# Altium schematic sheet captivate_phone.SchDoc: TICAPEVM_PHONE Capacitive Touch Panel PCB
size Letter; Date: Not shown in title block; ApprovedBy: Not shown in title block; CheckedBy: Not shown in title block; Author: Not shown in title block; CompanyName: Not shown in title block; Engineer: Not shown in title block; Organization: Not shown in title block; Address1: Not shown in title block; Address2: Not shown in title block; Address3: Not shown in title block; Address4: Not shown in title block; DocumentNumber: 1; Revision: Use project parameter SCH_Rev; SheetNumber: 1; SheetTotal: 1; PageSetup: Record=PageOptions|CenterHorizontal=True|CenterVertical=True|PrintScale=0.94|XCorrection=1.00|YCorrection=1.00|PrintKind=0|BorderSize=5000000|LeftOffset=0|BottomOffset=0|Orientation=2|PaperLength=1000|PaperWidth=1000|Scale=100|PaperSource=15|PrintQuality=600|MediaType=1|DitherType=10|PaperKind=Letter|PrintScaleMode=1; CurrentTime: Not shown in title block; CurrentDate: Not shown in title block; Time: Not shown in title block; DocumentFullPathAndName: Not shown in title block; DocumentName: Not shown in title block; ModifiedDate: Not shown in title block; ImagePath: Not shown in title block
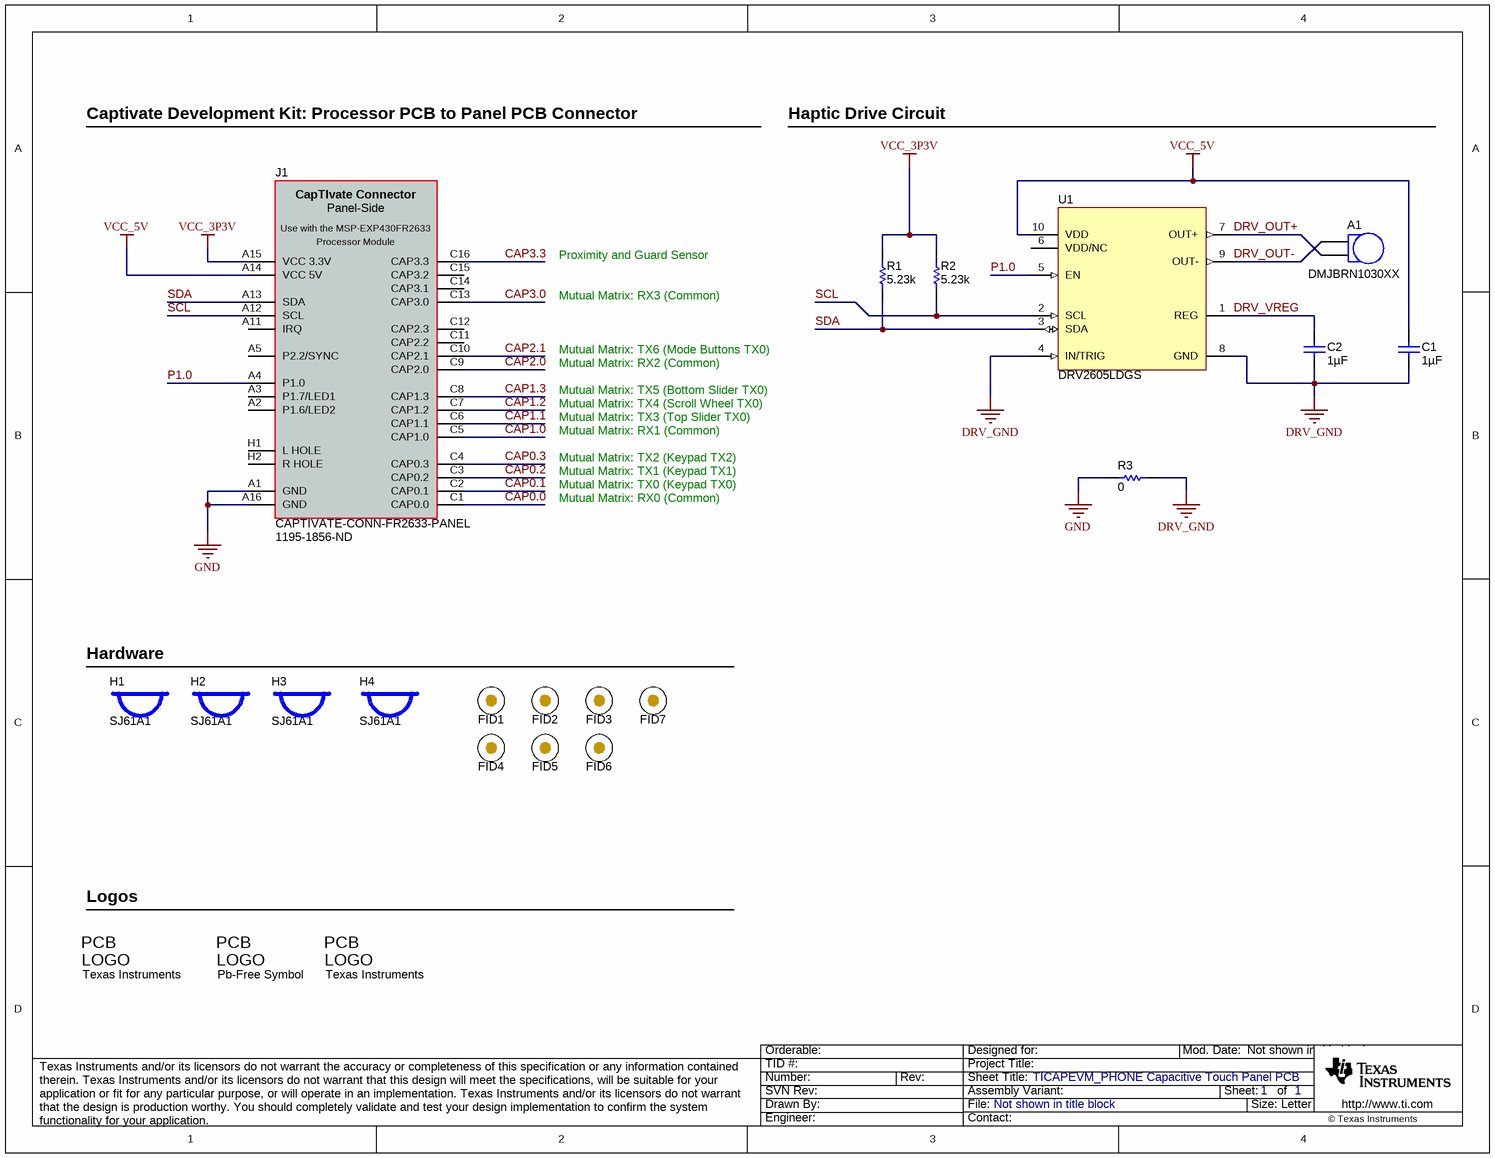
[diagram p0: captivate_phone.SchDoc]

## Parts
A1  DMJBRN1030XX  [SEMCO1030]
C1  ValueDisplayed: 1µF  [0603]  (hidden comment: C0603C105K8PACTU)
C2  ValueDisplayed: 1µF  [0603]  (hidden comment: C0603C105K8PACTU)
FID1  Fiducial  [Fiducial10-20]  (value not drawn)
FID2  Fiducial  [Fiducial10-20]  (value not drawn)
FID3  Fiducial  [Fiducial10-20]  (value not drawn)
FID4  Fiducial  [Fiducial10-20]  (value not drawn)
FID5  Fiducial  [Fiducial10-20]  (value not drawn)
FID6  Fiducial  [Fiducial10-20]  (value not drawn)
FID7  Fiducial  [Fiducial10-20]  (value not drawn)
H1  SJ61A1  [Bumpon_SJ61A1]
H2  SJ61A1  [Bumpon_SJ61A1]
H3  SJ61A1  [Bumpon_SJ61A1]
H4  SJ61A1  [Bumpon_SJ61A1]
J1  CAPTIVATE-CONN-FR2633-PANEL  Supplier Part Number 1: 1195-1856-ND  [CAPTIVATE-CONN-48]
Logo1  Pb-Free Symbol  [Pb-Free_Overlay_Medium]  (no BOM)
Logo2  Texas Instruments  [TI_Horizontal_Overlay_Medium]  (no BOM)
Logo3  Texas Instruments  [TI_Horizontal_Overlay_Medium]  (no BOM)
R1  ValueDisplayed: 5.23k  [0603]  (hidden comment: CRCW06035K23FKEA)
R2  ValueDisplayed: 5.23k  [0603]  (hidden comment: CRCW06035K23FKEA)
R3  ValueDisplayed: 0  [0603]  (hidden comment: CRCW06030000Z0EA)
U1  DRV2605LDGS  [DGS0010A_L]

## Nets
DRV_GND: C1.2 C2.2 R3.1 U1.4(IN/TRIG) U1.8(GND)
GND: J1.A1(GND) J1.A16(GND) R3.2
VCC_3P3V: J1.A15(VCC_3.3V) R1.2 R2.2
VCC_5V: C1.1 J1.A14(VCC_5V) U1.10(VDD)
CAP0.0: J1.C1(CAP0.0)
CAP0.1: J1.C2(CAP0.1)
CAP0.2: J1.C3(CAP0.2)
CAP0.3: J1.C4(CAP0.3)
CAP1.0: J1.C5(CAP1.0)
CAP1.1: J1.C6(CAP1.1)
CAP1.2: J1.C7(CAP1.2)
CAP1.3: J1.C8(CAP1.3)
CAP2.0: J1.C9(CAP2.0)
CAP2.1: J1.C10(CAP2.1)
CAP3.0: J1.C13(CAP3.0)
CAP3.3: J1.C16(CAP3.3)
DRV_OUT+: A1.2 U1.7(OUT+)
DRV_OUT-: A1.1 U1.9(OUT-)
DRV_VREG: C2.1 U1.1(REG)
P1.0: J1.A4(P1.0) U1.5(EN)
SCL: J1.A12(SCL) R2.1 U1.2(SCL)
SDA: J1.A13(SDA) R1.1 U1.3(SDA)

Not connected (* = marked no-connect by the designer): J1 A2(P1.6/LED2) A3(P1.7/LED1) A5(P2.2/SYNC) A11(IRQ) C11(CAP2.2) C12(CAP2.3) C14(CAP3.1) C15(CAP3.2) H1(L_HOLE) H2(R_HOLE); U1 6(VDD/NC)

## Notes on the sheet
- Captivate Development Kit: Processor PCB to Panel PCB Connector
- Haptic Drive Circuit
- Mutual Matrix: RX3 (Common)
- Proximity and Guard Sensor
- Mutual Matrix: RX2 (Common)
- Mutual Matrix: TX6 (Mode Buttons TX0)
- Mutual Matrix: RX1 (Common)
- Mutual Matrix: TX3 (Top Slider TX0)
- Mutual Matrix: TX4 (Scroll Wheel TX0)
- Mutual Matrix: TX5 (Bottom Slider TX0)
- Mutual Matrix: RX0 (Common)
- Mutual Matrix: TX0 (Keypad TX0)
- Mutual Matrix: TX1 (Keypad TX1)
- Mutual Matrix: TX2 (Keypad TX2)
- (near H1) Hardware
- (near Logo2) Logos
- Drawn By:
- SVN Rev:
- Number:
- TID #:
- Orderable:
- Rev:
- Sheet Title:
- File:
- Project Title:
- Designed for:
- Assembly Variant:
- Mod. Date:
- Sheet:
- Size:
- of
- Letter
- http://www.ti.com
- Texas Instruments and/or its licensors do not warrant the accuracy or completeness of this specification or any information contained therein. Texas Instruments and/or its licensors do not warrant that this design will meet the specifications, will be suitable for your application or fit for any particular purpose, or will operate in an implementation. Texas Instruments and/or its licensors do not warrant that the design is production worthy. You should completely validate and test your design implementation to confirm the system functionality for your application.
- Engineer:
- Contact:
- © Texas Instruments
- (in symbol CAPTIVATE-CONN-MSP-EXP430FR2633-PANEL) CapTIvate Connector; Panel-Side; Use with the MSP-EXP430FR2633; Processor Module
- (in symbol Pb-Free) PCB; LOGO
- (in symbol TI_Logo) PCB; LOGO

## Library data of the parts
A1 = DMJBRN1030XX: Linear Resonant Actuator; Manufacturer: Samsung Electro-Mechanics; SymbolCreator: a0273983; U/M: EA, IN, or GM; SymbolVersion: 2015-3-12; MountType: Wire lead, 30mm; RoHS: Y; PartNumber: DMJBRN1030XX; PackageReference: 10mm dia x 3mm height; ComponentLink1Description: Datasheet Link; CompType: Linear Resonant Actuator; Alternate PartNumber: -; Alternate Manufacturer: -; Supplier 1: Avnet; Supplier Part Number 1: DMJBRN1030BK
C1 C2 = C0603C105K8PACTU: CAP, CERM, 1 µF, 10 V, +/- 10%, X5R, 0603; Manufacturer: Kemet; Polarized: N; CompType: Capacitor; Value: 1uF; U/M: EA; Cap_F: 0.000001; Tolerance_%: 10; Value1: Unknown; Value2: 10V; TaMin_C: -55; TaMax_C: 85; SymbolVersion: 2008-07-09; PartNumber: C0603C105K8PACTU; PackageReference: 0603; RoHS: Y; VDC_V: 10; MountType: SMT; Technology: Ceramic; TempCo: X5R; Cap_Case: 0603; Published: 2008-06-19; Publisher: Texas Instruments; LatestRevisionDate: 2014-12-04; ComponentLink1Description: Datasheet link; ComponentLink1URL: http://www.kemet.com/kemet/web/homepage/kechome.nsf/vapubfiles/F3102_Y5V.pdf/$file/F3102_Y5V.pdf; Supplier 1: Digi-Key; Supplier Part Number 1: 399-3118-1-ND; Supplier 2: Mouser; Supplier Part Number 2: 80-C0603C105K8P; Supplier 3: Farnell; Supplier Part Number 3: 9227776
FID1-FID7 = Fiducial: Fiducial mark.  There is nothing to buy or mount.; SymbolCreator: codlsc; SymbolVersion: 2009-11-4; CompType: Fiducial; PackageReference: N/A; ClassName: FiducialMark; Manufacturer: N/A; PartNumber: N/A; MountType: N/A; Publisher: Texas Instruments; LatestRevisionDate: 2014-10-27; LatestRevisionNote: Added Alternate PartNumber and Alternate Manufacturer parameters to appropriate components.
H1-H4 = SJ61A1: Bumpon, Cylindrical, 0.312 X 0.200, Black; Manufacturer: 3M; SymbolCreator: a0412235; SymbolVersion: 2012-03-04; CompType: Bumpon; PartNumber: SJ61A1; RoHS: Y; PackageReference: Black Bumpon; MountType: N/A; ComponentLink1Description: Datasheet Link; ComponentLink1URL: http://multimedia.3m.com/mws/mediawebserver?mwsId=66666UF6EVsSyXTtOxTXoxMtEVtQEVs6EVs6EVs6E666666--&fn=SJxxA1.pdf; Publisher: Texas Instruments; LatestRevisionDate: 2014-11-19; Supplier 1: Digi-Key; Supplier Part Number 1: SJ5746-0-ND; Supplier 2: Mouser; Supplier Part Number 2: 517-SJ-61A1
J1 = CAPTIVATE-CONN-MSP-EXP430FR2633-PANEL: CapTIvate Panel-Side Connector, 3x16, 100mil, TH, RA, M, MSP-EXP430FR2633; Manufacturer: Used in BOM report; SymbolCreator: a0273983; U/M: EA, IN, or GM; SymbolVersion: 2015-1-5; MountType: SMT, TH, or N/A; RoHS: Y; PartNumber: CAPTIVATE-CONN-FR2633-PANEL; PackageReference: eg:  0603, used in PnP report; ComponentLink1Description: Datasheet Link; CompType: Connector; Alternate PartNumber: -; Alternate Manufacturer: -; Supplier 1: Digi-Key; Supplier 2: Digi-Key; Supplier Part Number 2: 609-2112-ND
Logo1 = Pb-Free: SymbolCreator: a0412235; SymbolVersion: 2011-08-22; Published: 2009-03-03; Publisher: Texas Instruments; LatestRevisionDate: 2014-11-20
Logo2 = TI_Logo: Texas Instrument Corporate Signature; SymbolCreator: codlsc; SymbolVersion: 2011-08-22; ClassName: Logo; Published: 2009-03-03; Publisher: Texas Instruments; LatestRevisionDate: 2012-05-17; LatestRevisionNote: Changed publisher
Logo3 = TI_Logo: Texas Instrument Corporate Signature; SymbolCreator: a0412235; SymbolVersion: 2011-08-22; ClassName: Logo; Published: 2009-03-03; Publisher: Texas Instruments; LatestRevisionDate: 2014-11-20
R1 R2 = CRCW06035K23FKEA: RES, 5.23 k, 1%, 0.1 W, 0603; Manufacturer: Vishay-Dale; CompType: Resistor; Value: 5.23k; Res_ohm: 5230; Value_Code: 5k23; Tolerance_%: 1; Power_W: 0.1; Value2: 0.1W; VDC_V: 75; TempCo: 100 ppm/C; EIA_Code: E96; U/M: EA; SymbolVersion: 2009-05-29; PartNumber: CRCW06035K23FKEA; PackageReference: 0603; RoHS: Y; Value1: 1%; MountType: SMT; Technology: Thick Film; Published: 2008-06-26; Publisher: Texas Instruments; LatestRevisionDate: 2014-12-01; ComponentLink1Description: Datasheet link; ComponentLink1URL: http://www.vishay.com/docs/20035/dcrcwe3.pdf; Supplier 1: Digi-Key; Supplier Part Number 1: 541-5.23KHCT-ND; Supplier 2: Mouser; Supplier Part Number 2: 71-CRCW0603-5.23K-E3; Supplier 3: Farnell; Supplier Part Number 3: 1652893
R3 = CRCW06030000Z0EA: RES, 0, 5%, 0.1 W, 0603; Manufacturer: Vishay-Dale; CompType: Resistor; Value: 0; Value_Code: 0000; Tolerance_%: 5; Power_W: 0.1; Value2: 0.1W; VDC_V: 75; TempCo: 200 ppm/C; EIA_Code: E24; U/M: EA; SymbolVersion: 2009-05-29; PartNumber: CRCW06030000Z0EA; PackageReference: 0603; RoHS: Y; Res_ohm: 0; Value1: 5%; MountType: SMT; Technology: Thick Film; Published: 2008-06-26; Publisher: Texas Instruments; LatestRevisionDate: 2014-12-01; ComponentLink1Description: Datasheet link; ComponentLink1URL: http://www.vishay.com/docs/20035/dcrcwe3.pdf; Supplier 1: Digi-Key; Supplier Part Number 1: 541-0.0GCT-ND; Supplier 2: Mouser; Supplier Part Number 2: 71-CRCW0603-0-E3; Supplier 3: Farnell; Supplier Part Number 3: 1469739
U1 = DRV2605LDGS: Haptic Driver for LRA and ERM With Built-In Library and Smart Loop Architecture, DGS0010A; Manufacturer: Texas Instruments; SymbolCreator: a0411947; CompType: IC; U/M: EA; SymbolVersion: 2014-06-25; PartNumber: DRV2605LDGS; PackageReference: DGS0010A; MountType: SMT; ComponentLink1Description: Datasheet Link; ComponentLink1URL: https://sps06.itg.ti.com/sites/KMS/crossdivteams/altium/docs/ComponentDatasheets/DRV2605L-Q1_Preliminary_Datasheet_Jul_18_2014.pdf; RoHS: Y; Publisher: Texas Instruments; LatestRevisionDate: 2014-12-02; Alternate Manufacturer: Texas Instruments